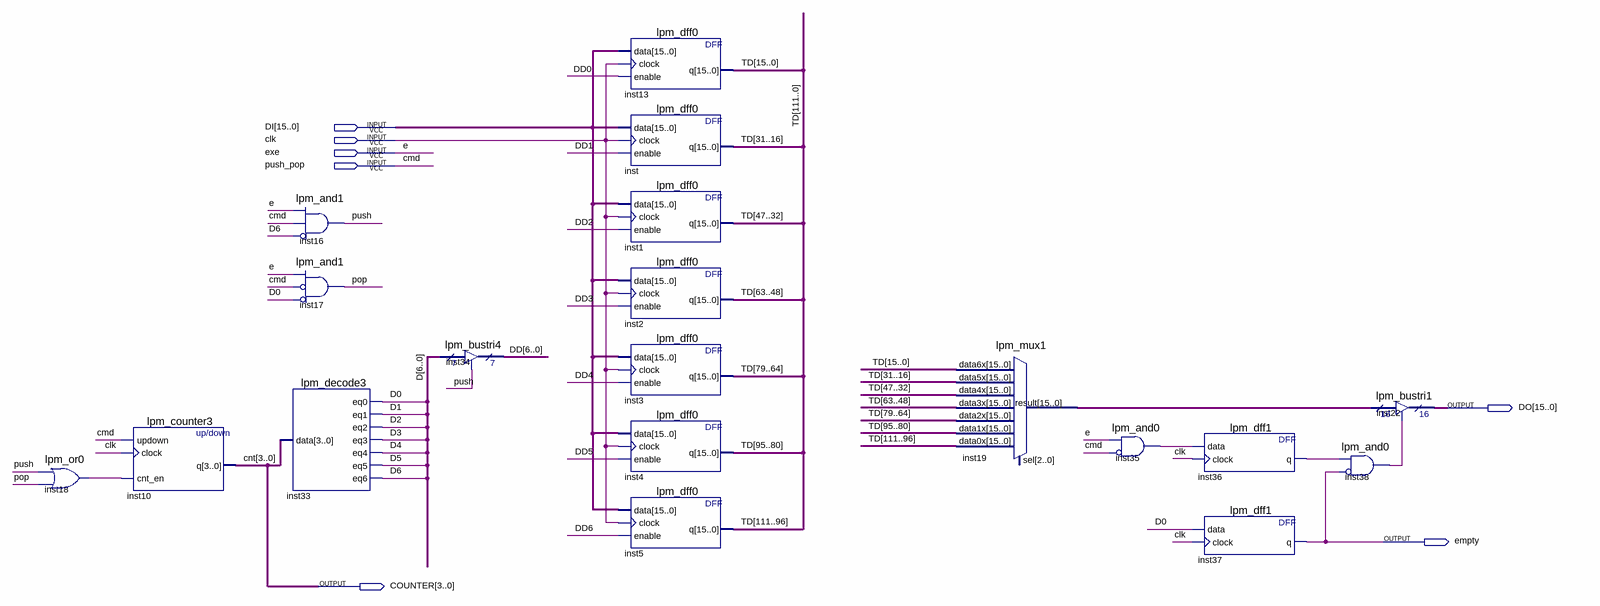
[diagram p0: schematic sheet]
// Quartus schematic Stack.bdf as structural Verilog: 19 symbols, 7 pins
module Stack (
  input  [15:0] DI,
  input  clk,
  input  exe,
  input  push_pop,
  output [15:0] DO,
  output empty,
  output [3:0] COUNTER
);

  wire inst18_result, inst35_result, inst36_q, inst38_result, pop, push;
  wire [6:0] D, DD;
  wire [15:0] inst19_result;
  wire [111:0] TD;

  lpm_or0 inst18 (.data0(push), .data1(pop), .result(inst18_result));
  lpm_counter3 inst10 (.updown(push_pop), .clock(clk), .cnt_en(inst18_result), .q(COUNTER));
  lpm_and1 inst16 (.data0(exe), .data1(push_pop), .data2(~D[6]), .result(push));
  lpm_and1 inst17 (.data0(exe), .data1(~push_pop), .data2(~D[0]), .result(pop));
  lpm_decode3 inst33 (
    .data(COUNTER), .eq0(D[0]), .eq1(D[1]), .eq2(D[2]), .eq3(D[3]), .eq4(D[4]), .eq5(D[5]), .eq6(D[6]));
  lpm_bustri4 inst34 (.enabledt(push), .data(D), .tridata(DD));
  lpm_dff0 inst13 (.data(DI), .clock(clk), .enable(DD[0]), .q(TD[15:0]));
  lpm_dff0 inst (.data(DI), .clock(clk), .enable(DD[1]), .q(TD[31:16]));
  lpm_dff0 inst1 (.data(DI), .clock(clk), .enable(DD[2]), .q(TD[47:32]));
  lpm_dff0 inst2 (.data(DI), .clock(clk), .enable(DD[3]), .q(TD[63:48]));
  lpm_dff0 inst3 (.data(DI), .clock(clk), .enable(DD[4]), .q(TD[79:64]));
  lpm_dff0 inst4 (.data(DI), .clock(clk), .enable(DD[5]), .q(TD[95:80]));
  lpm_dff0 inst5 (.data(DI), .clock(clk), .enable(DD[6]), .q(TD[111:96]));
  lpm_mux1 inst19 (
    .data6x(TD[15:0]), .data5x(TD[31:16]), .data4x(TD[47:32]), .data3x(TD[63:48]), .data2x(TD[79:64]),
    .data1x(TD[95:80]), .data0x(TD[111:96]), .result(inst19_result));  // open: sel
  lpm_and0 inst35 (.data0(exe), .data1(~push_pop), .result(inst35_result));
  lpm_dff1 inst36 (.data(inst35_result), .clock(clk), .q(inst36_q));
  lpm_dff1 inst37 (.data(D[0]), .clock(clk), .q(empty));
  lpm_bustri1 inst22 (.enabledt(inst38_result), .data(inst19_result), .tridata(DO));
  lpm_and0 inst38 (.data0(inst36_q), .data1(~empty), .result(inst38_result));

  // Other names for the same wires on the sheet: cmd = push_pop; cnt[3:0] = COUNTER; e = exe
endmodule
